# Altium project XDRONE.PrjPcb
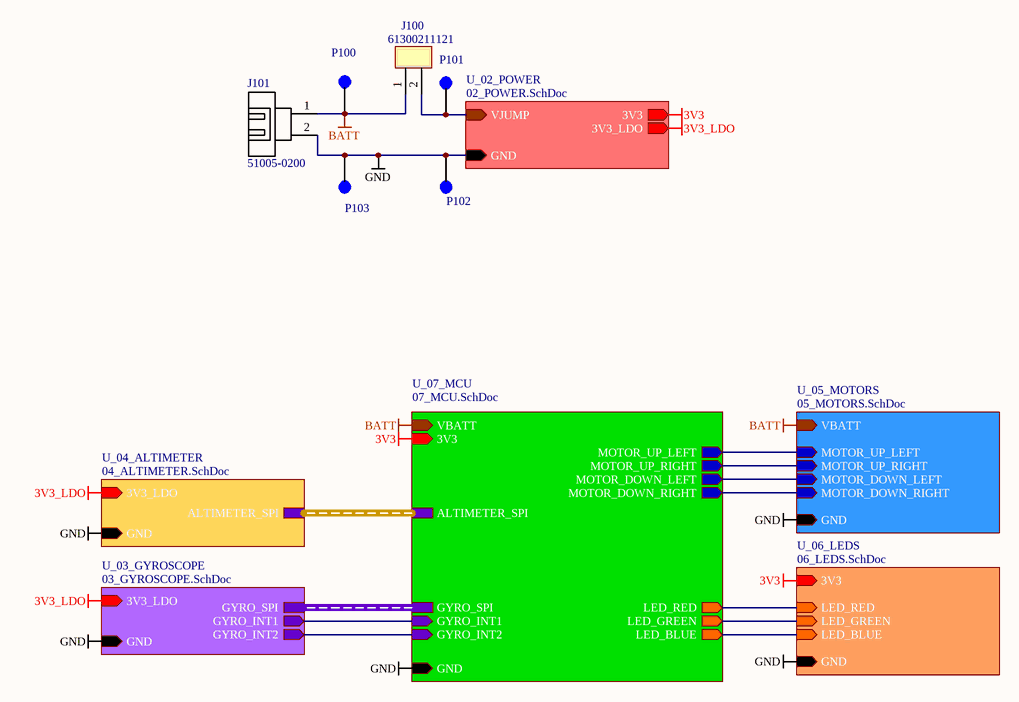
[diagram p0: 01_XDRONE.SchDoc]
8 sheets, 129 parts. Net scope: hierarchical (ports join the sheet entries above them; power ports are global).
Board file: XDRONE.PcbDoc
Sheets:
  01_XDRONE.SchDoc
    U_04_ALTIMETER = 04_ALTIMETER.SchDoc
    U_03_GYROSCOPE = 03_GYROSCOPE.SchDoc
    U_07_MCU = 07_MCU.SchDoc
      U_08_MCU_POWER = 08_MCU_POWER.SchDoc
    U_06_LEDS = 06_LEDS.SchDoc
    U_05_MOTORS = 05_MOTORS.SchDoc
    U_02_POWER = 02_POWER.SchDoc

## Sheet 01_XDRONE.SchDoc: XDRONE
size A4; Author: Gabriel; Organization: Altium Limited; Address1: L3, 12a Rodborough Rd; Address2: Frenchs Forest; Address3: NSW; Address4: Australia 2086; Revision: v2.0; SheetNumber: 1; SheetTotal: 8; Subtitle: MAIN

### Parts
J100  MANUFACTURER REFERENCE: 61300211121  [CON_2x1PIN_RA_61300211121]  (hidden comment: CON_2x1PIN_ST_61300211121_2.54)
J101  MANUFACTURER REFERENCE: 51005-0200  [CON_2x1PIN_MOLEX_51005-0200]  (hidden comment: CON_2x1PIN_MALE_51005-0200)
P100  TEST_POINT_2mm  [TEST_POINT_2mm]  (value not drawn)
P101  TEST_POINT_2mm  [TEST_POINT_2mm]  (value not drawn)
P102  TEST_POINT_2mm  [TEST_POINT_2mm]  (value not drawn)
P103  TEST_POINT_2mm  [TEST_POINT_2mm]  (value not drawn)

### Sub-sheets
U_02_POWER = 02_POWER.SchDoc: GND (in), 3V3 (out), 3V3_LDO (out), VJUMP (in)
U_03_GYROSCOPE = 03_GYROSCOPE.SchDoc: GND (in), GYRO_INT1 (out), GYRO_INT2 (out), GYRO_SPI (harness GYRO_SPI), 3V3_LDO (in)
U_04_ALTIMETER = 04_ALTIMETER.SchDoc: GND (in), ALTIMETER_SPI (harness ALTIMETER_SPI), 3V3_LDO (in)
U_05_MOTORS = 05_MOTORS.SchDoc: GND (in), VBATT (in), MOTOR_UP_LEFT (in), MOTOR_UP_RIGHT (in), MOTOR_DOWN_LEFT (in), MOTOR_DOWN_RIGHT (in)
U_06_LEDS = 06_LEDS.SchDoc: LED_GREEN (in), LED_RED (in), LED_BLUE (in), GND (in), 3V3 (in)
U_07_MCU = 07_MCU.SchDoc: GND (in), 3V3 (in), ALTIMETER_SPI (harness ALTIMETER_SPI), GYRO_SPI (harness GYRO_SPI), MOTOR_UP_LEFT (out), MOTOR_UP_RIGHT (out), MOTOR_DOWN_LEFT (out), MOTOR_DOWN_RIGHT (out), VBATT (in), LED_RED (out), LED_GREEN (out), LED_BLUE (out), GYRO_INT1 (in), GYRO_INT2 (in)

### Nets
3V3: sheet U_07_MCU/3V3, sheet U_06_LEDS/3V3, sheet U_02_POWER/3V3
3V3_LDO: sheet U_04_ALTIMETER/3V3_LDO, sheet U_03_GYROSCOPE/3V3_LDO, sheet U_02_POWER/3V3_LDO
BATT: J100.1 J101.1(GND) P100.1 ; sheet U_07_MCU/VBATT, sheet U_05_MOTORS/VBATT
GND: J101.2(VBATT) P102.1 P103.1 ; sheet U_04_ALTIMETER/GND, sheet U_03_GYROSCOPE/GND, sheet U_07_MCU/GND, sheet U_06_LEDS/GND, sheet U_05_MOTORS/GND, sheet U_02_POWER/GND
GYRO_INT1: sheet U_03_GYROSCOPE/GYRO_INT1, sheet U_07_MCU/GYRO_INT1
GYRO_INT2: sheet U_03_GYROSCOPE/GYRO_INT2, sheet U_07_MCU/GYRO_INT2
LED_BLUE: sheet U_07_MCU/LED_BLUE, sheet U_06_LEDS/LED_BLUE
LED_GREEN: sheet U_07_MCU/LED_GREEN, sheet U_06_LEDS/LED_GREEN
LED_RED: sheet U_07_MCU/LED_RED, sheet U_06_LEDS/LED_RED
MOTOR_DOWN_LEFT: sheet U_07_MCU/MOTOR_DOWN_LEFT, sheet U_05_MOTORS/MOTOR_DOWN_LEFT
MOTOR_DOWN_RIGHT: sheet U_07_MCU/MOTOR_DOWN_RIGHT, sheet U_05_MOTORS/MOTOR_DOWN_RIGHT
MOTOR_UP_LEFT: sheet U_07_MCU/MOTOR_UP_LEFT, sheet U_05_MOTORS/MOTOR_UP_LEFT
MOTOR_UP_RIGHT: sheet U_07_MCU/MOTOR_UP_RIGHT, sheet U_05_MOTORS/MOTOR_UP_RIGHT
NetD201_2: J100.2 P101.1 ; sheet U_02_POWER/VJUMP

### Buses and harness runs
harness sheet U_03_GYROSCOPE/GYRO_SPI = sheet U_07_MCU/GYRO_SPI
harness sheet U_04_ALTIMETER/ALTIMETER_SPI = sheet U_07_MCU/ALTIMETER_SPI

### Notes on the sheet
- TITLE:
- CREATED BY
- MODIFIED DATE
- REV
- PAGE
- /

### Library data of the parts
J100 = CON_2x1PIN_ST_61300211121_2.54: CONNECTOR 2x1 PIN ST 61300211121 WE 2.54 PITCH; CURRENT RATING: 3A; ANGLE: STRAIGHT; PITCH: 2.54 mm; GENDER: MALE; ROWS: 1; COLUMNS: 2; MANUFACTURER: WE; MOUNTING: THT
J101 = CON_2x1PIN_MALE_51005-0200: CONNECTOR 2x1PIN MALE 51005-0200; MANUFACTURER: MOLEX; ANGLE: STRAIGHT; ROWS: 2; COLUMNS: 1; MOUNTING: SMD; GENDER: MALE
P100-P103 = TEST_POINT_2mm: MOUNTING: SMD

## Sheet 04_ALTIMETER.SchDoc: ALTIMETER
size A4; Author: Gabriel; Organization: Altium Limited; Address1: L3, 12a Rodborough Rd; Address2: Frenchs Forest; Address3: NSW; Address4: Australia 2086; Revision: v2.0; SheetNumber: 4; SheetTotal: 8; Subtitle: XDRONE
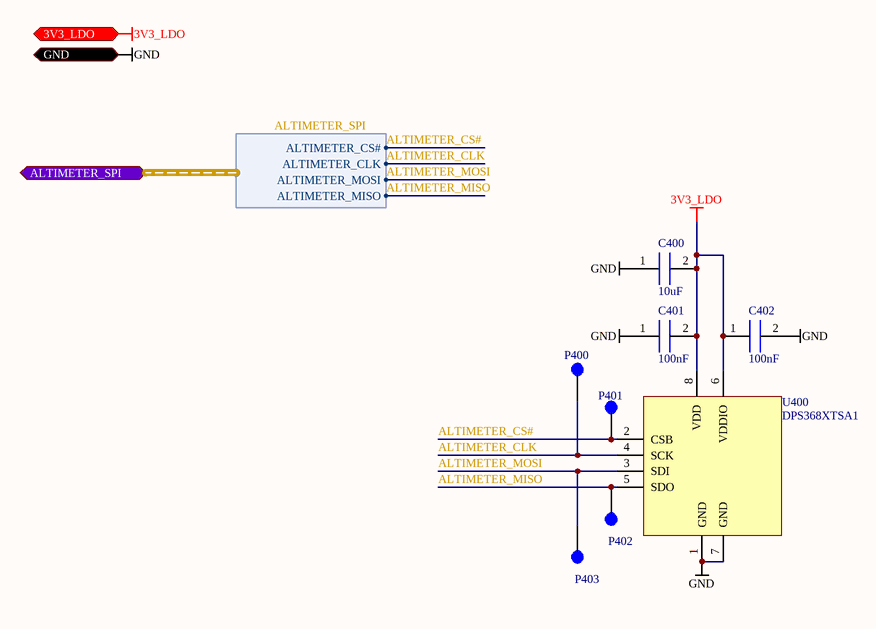
[diagram p1: 04_ALTIMETER.SchDoc]

### Parts
C400  value 10uF  [CAP_0402]  (hidden comment: 10uF_20%_6.3V_0402_GRM155R60J106ME05D)
C401  value 100nF  [CAP_0402]  (hidden comment: 100nF_10%_16V_0402_GRM155R71C104KA88J)
C402  value 100nF  [CAP_0402]  (hidden comment: 100nF_10%_16V_0402_GRM155R71C104KA88J)
P400  TEST_POINT_2mm  [TEST_POINT_2mm]  (value not drawn)
P401  TEST_POINT_2mm  [TEST_POINT_2mm]  (value not drawn)
P402  TEST_POINT_2mm  [TEST_POINT_2mm]  (value not drawn)
P403  TEST_POINT_2mm  [TEST_POINT_2mm]  (value not drawn)
U400  BAR_4V_0.002hPA_500nA_DPS368XTSA1  [DPS368XTSA1]  (value not drawn)

### Ports
3V3_LDO (in), ALTIMETER_SPI (harness ALTIMETER_SPI), GND (in)

### Harnesses
ALTIMETER_SPI: ALTIMETER_MISO, ALTIMETER_MOSI, ALTIMETER_CLK, ALTIMETER_CS#

### Nets
3V3_LDO: C400.2 C401.2 C402.1 U400.6(VDDIO) U400.8(VDD) ; port 3V3_LDO
GND: C400.1 C401.1 C402.2 U400.1(GND) U400.7(GND) ; port GND
ALTIMETER_CLK: P400.1 U400.4(SCK) ; port ALTIMETER_SPI.ALTIMETER_CLK
ALTIMETER_CS#: P401.1 U400.2(CSB) ; port ALTIMETER_SPI.ALTIMETER_CS#
ALTIMETER_MISO: P402.1 U400.5(SDO) ; port ALTIMETER_SPI.ALTIMETER_MISO
ALTIMETER_MOSI: P403.1 U400.3(SDI) ; port ALTIMETER_SPI.ALTIMETER_MOSI

### Notes on the sheet
- TITLE:
- CREATED BY
- MODIFIED DATE
- REV
- PAGE
- /

### Library data of the parts
C400 = 10uF 20% 6.3V 0402 GRM155R60J106ME05D: CAPACITOR 10uF 20% 6.3V 0402 GRM155R60J106ME05D; MANUFACTURER: MURATA; DIELECTRIC: X5R; TOLERANCE: 20%; VOLTAGE RATING: 6.3V; PACKAGING: 0402; MOUNTING: SMD; MANUFACTURER REFERENCE: GRM155R60J106ME05D
C401 C402 = 100nF_10%_16V_0402_GRM155R71C104KA88J: CAPACITOR 100nF 10% X7R 0402; MANUFACTURER: MURATA; VOLTAGE RATING: 16V; DIELECTRIC: X7R; TOLERANCE: 10%; MOUNTING: SMD; MANUFACTURER REFERENCE: GRM155R71C104KA88J; PACKAGING: 0402
U400 = BAR_4V_0.002hPA_500nA_DPS368XTSA1: BAROMETRIC SENSOR 4V 0.002hPA 500nA DPS368XTSA1; MANUFACTURER: INFINEON; INPUT VOLTAGE MIN: 1.7V; CURRENT MAX: 350uA; NUMBER OF GATES: 1; INPUT VOLTAGE MAX: 4V; PACKAGING: 8-VFLGA; MOUNTING: SMD; MANUFACTURER REFERENCE: DPS368XTSA1
P400-P403 = TEST_POINT_2mm: MOUNTING: SMD

## Sheet 03_GYROSCOPE.SchDoc: GYRO
size A4; Author: Gabriel; Organization: Altium Limited; Address1: L3, 12a Rodborough Rd; Address2: Frenchs Forest; Address3: NSW; Address4: Australia 2086; Revision: v2.0; SheetNumber: 3; SheetTotal: 8; Subtitle: XDRONE
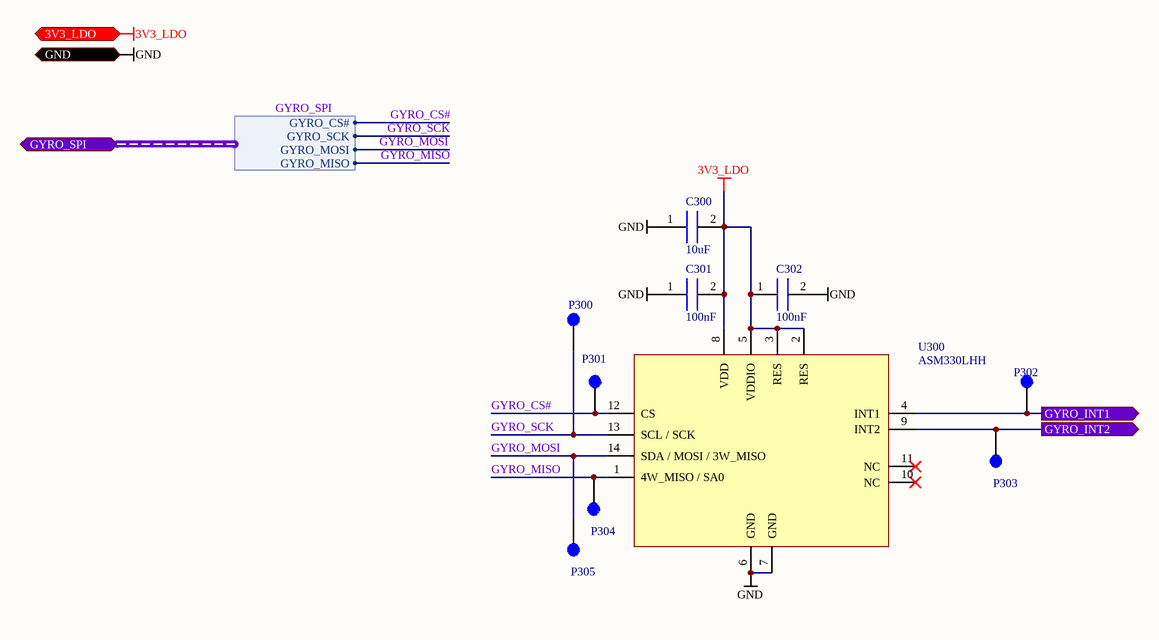
[diagram p2: 03_GYROSCOPE.SchDoc]

### Parts
C300  value 10uF  [CAP_0402]  (hidden comment: 10uF_20%_6.3V_0402_GRM155R60J106ME05D)
C301  value 100nF  [CAP_0402]  (hidden comment: 100nF_10%_16V_0402_GRM155R71C104KA88J)
C302  value 100nF  [CAP_0402]  (hidden comment: 100nF_10%_16V_0402_GRM155R71C104KA88J)
P300  TEST_POINT_2mm  [TEST_POINT_2mm]  (value not drawn)
P301  TEST_POINT_2mm  [TEST_POINT_2mm]  (value not drawn)
P302  TEST_POINT_2mm  [TEST_POINT_2mm]  (value not drawn)
P303  TEST_POINT_2mm  [TEST_POINT_2mm]  (value not drawn)
P304  TEST_POINT_2mm  [TEST_POINT_2mm]  (value not drawn)
P305  TEST_POINT_2mm  [TEST_POINT_2mm]  (value not drawn)
U300  MANUFACTURER REFERENCE: ASM330LHH  [LGA14]  (hidden comment: GYRO_3D_3.6V_ACEL_ASM330LHH)

### Ports
3V3_LDO (in), GND (in), GYRO_INT1 (out), GYRO_INT2 (out), GYRO_SPI (harness GYRO_SPI)

### Harnesses
GYRO_SPI: GYRO_CS#, GYRO_SCK, GYRO_MOSI, GYRO_MISO

### Nets
3V3_LDO: C300.2 C301.2 C302.1 U300.2(RES) U300.3(RES) U300.5(VDDIO) U300.8(VDD) ; port 3V3_LDO
GND: C300.1 C301.1 C302.2 U300.6(GND) U300.7(GND) ; port GND
GYRO_CS#: P301.1 U300.12(CS) ; port GYRO_SPI.GYRO_CS#
GYRO_INT1: P302.1 U300.4(INT1) ; port GYRO_INT1
GYRO_INT2: P303.1 U300.9(INT2) ; port GYRO_INT2
GYRO_MISO: P304.1 U300.1(4W_MISO_/_SA0) ; port GYRO_SPI.GYRO_MISO
GYRO_MOSI: P305.1 U300.14(SDA_/_MOSI_/_3W_MISO) ; port GYRO_SPI.GYRO_MOSI
GYRO_SCK: P300.1 U300.13(SCL_/_SCK) ; port GYRO_SPI.GYRO_SCK

Not connected (* = marked no-connect by the designer): U300 10(NC)* 11(NC)*

### Notes on the sheet
- TITLE:
- CREATED BY
- MODIFIED DATE
- REV
- PAGE
- /

### Library data of the parts
C300 = 10uF 20% 6.3V 0402 GRM155R60J106ME05D: as C400 on sheet 04_ALTIMETER; TOLERANCE: 20%; VOLTAGE RATING: 6.3V; PACKAGING: 0402; MOUNTING: SMD; MANUFACTURER REFERENCE: GRM155R60J106ME05D
C301 C302 = 100nF_10%_16V_0402_GRM155R71C104KA88J: as C401 on sheet 04_ALTIMETER; DIELECTRIC: X7R; TOLERANCE: 10%; MOUNTING: SMD; MANUFACTURER REFERENCE: GRM155R71C104KA88J; PACKAGING: 0402
U300 = GYRO_3D_3.6V_ACEL_ASM330LHH: Gyroscope and accelerometer 3D 3.6V ASM330LHH; MANUFACTURER: ST; INPUT VOLTAGE MIN: 2V; INPUT VOLTAGE MAX: 3.6V; PACKAGING: 14-LGA; MOUNTING: SMD
P300-P305 = TEST_POINT_2mm: MOUNTING: SMD

## Sheet 07_MCU.SchDoc: MCU
size A4; Author: Gabriel; Organization: Altium Limited; Address1: L3, 12a Rodborough Rd; Address2: Frenchs Forest; Address3: NSW; Address4: Australia 2086; Revision: v2.0; SheetNumber: 7; SheetTotal: 8; Subtitle: XDRONE
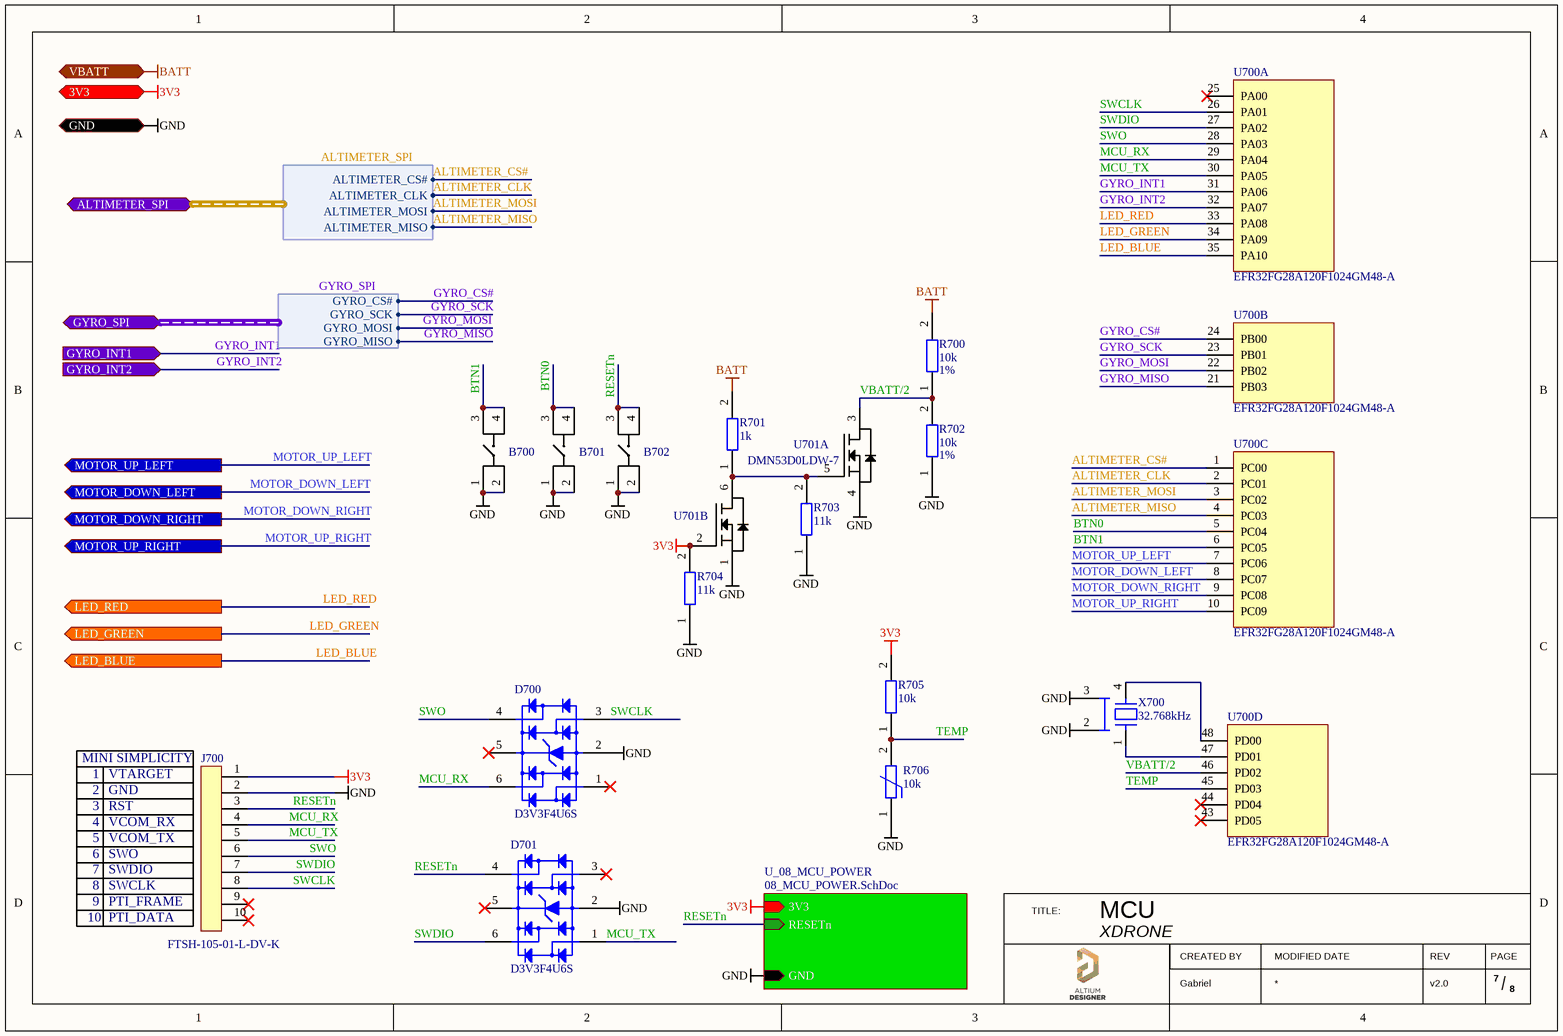
[diagram p3: 07_MCU.SchDoc]

### Parts
B700  BTN_1B_PTS647SK38SMTR2LFS  [BTN_SMD]  (value not drawn)
B701  BTN_1B_PTS647SK38SMTR2LFS  [BTN_SMD]  (value not drawn)
B702  BTN_1B_PTS647SK38SMTR2LFS  [BTN_SMD]  (value not drawn)
D700  MANUFACTURER REFERENCE: D3V3F4U6S  [SOT-363 SC-70-6]  (hidden comment: ESD_D3V3F4U6S)
D701  MANUFACTURER REFERENCE: D3V3F4U6S  [SOT-363 SC-70-6]  (hidden comment: ESD_D3V3F4U6S)
J700  MANUFACTURER REFERENCE: FTSH-105-01-L-DV-K  [CON_5x2PIN_RA_FTSH-105-01-L-DV-K]  (hidden comment: CON_5x2PIN_RA_1.27_FTSH-105-01-L-DV-K)
R700  value 10k  TOLERANCE: 1%  [RES_0402]  (hidden comment: RES_10k_1%_0402_RC0402FR-0710KL)
R701  value 1k  [RES_0402]  (hidden comment: RES_1k_1%_0402_RC0402FR-071KL)
R702  value 10k  TOLERANCE: 1%  [RES_0402]  (hidden comment: RES_10k_1%_0402_RC0402FR-0710KL)
R703  value 11k  [RES_0402]  (hidden comment: RES_11k_5%_0402_ERJ-2GEJ113X)
R704  value 11k  [RES_0402]  (hidden comment: RES_11k_5%_0402_ERJ-2GEJ113X)
R705  value 10k  [RES_0402]  (hidden comment: RES_10k_1%_0402_RC0402FR-0710KL)
R706  value 10k  [RES_0402]  (hidden comment: THER_10k_1%_0402_NTCG103JF103FT1)
U700  MANUFACTURER REFERENCE: EFR32FG28A120F1024GM48-A  [QFN48]  (hidden comment: MCU_1MB_256kB_EFR32FG28A120F1024GM48-A)  (parts A,B,C,D of 6)
U701  MANUFACTURER REFERENCE: DMN53D0LDW-7  [SOT-363 SC-70-6]  (hidden comment: MOS_2G_50VDS_360mA_0.8Vth_DMN53D0LDW-7)  (parts A,B of 2)
X700  FREQUENCY: 32.768kHz  [4-SOJ]  (hidden comment: QUARTZ_32.768kHz_20ppm_830016178)

### Sub-sheets
U_08_MCU_POWER = 08_MCU_POWER.SchDoc: GND (in), 3V3 (in), RESETn (in)

### Ports
3V3 (in), ALTIMETER_SPI (harness ALTIMETER_SPI), GND (in), GYRO_INT1 (in), GYRO_INT2 (in), GYRO_SPI (harness GYRO_SPI), LED_BLUE (out), LED_GREEN (out), LED_RED (out), MOTOR_DOWN_LEFT (out), MOTOR_DOWN_RIGHT (out), MOTOR_UP_LEFT (out), MOTOR_UP_RIGHT (out), VBATT (in)

### Harnesses
ALTIMETER_SPI: ALTIMETER_MISO, ALTIMETER_MOSI, ALTIMETER_CLK, ALTIMETER_CS#
GYRO_SPI: GYRO_CS#, GYRO_SCK, GYRO_MOSI, GYRO_MISO

### Nets
3V3: J700.1 R704.2 R705.2 U701.2 ; port 3V3, sheet U_08_MCU_POWER/3V3
BATT: R700.2 R701.2 ; port VBATT
GND: B700.1 B700.2 B701.1 B701.2 B702.1 B702.2 D700.2 D701.2 J700.2 R702.1 R703.1 R704.1 R706.1 U701.1 U701.4 X700.2 X700.3 ; port GND, sheet U_08_MCU_POWER/GND
ALTIMETER_CLK: U700.2(PC01) ; port ALTIMETER_SPI.ALTIMETER_CLK
ALTIMETER_CS#: U700.1(PC00) ; port ALTIMETER_SPI.ALTIMETER_CS#
ALTIMETER_MISO: U700.4(PC03) ; port ALTIMETER_SPI.ALTIMETER_MISO
ALTIMETER_MOSI: U700.3(PC02) ; port ALTIMETER_SPI.ALTIMETER_MOSI
BTN0: B701.3 B701.4 U700.5(PC04)
BTN1: B700.3 B700.4 U700.6(PC05)
GYRO_CS#: U700.24(PB00) ; port GYRO_SPI.GYRO_CS#
GYRO_INT1: U700.31(PA06) ; port GYRO_INT1
GYRO_INT2: U700.32(PA07) ; port GYRO_INT2
GYRO_MISO: U700.21(PB03) ; port GYRO_SPI.GYRO_MISO
GYRO_MOSI: U700.22(PB02) ; port GYRO_SPI.GYRO_MOSI
GYRO_SCK: U700.23(PB01) ; port GYRO_SPI.GYRO_SCK
LED_BLUE: U700.35(PA10) ; port LED_BLUE
LED_GREEN: U700.34(PA09) ; port LED_GREEN
LED_RED: U700.33(PA08) ; port LED_RED
MCU_RX: D700.6 J700.4 U700.29(PA04)
MCU_TX: D701.1 J700.5 U700.30(PA05)
MOTOR_DOWN_LEFT: U700.8(PC07) ; port MOTOR_DOWN_LEFT
MOTOR_DOWN_RIGHT: U700.9(PC08) ; port MOTOR_DOWN_RIGHT
MOTOR_UP_LEFT: U700.7(PC06) ; port MOTOR_UP_LEFT
MOTOR_UP_RIGHT: U700.10(PC09) ; port MOTOR_UP_RIGHT
RESETn: B702.3 B702.4 D701.4 J700.3 ; sheet U_08_MCU_POWER/RESETn
SWCLK: D700.3 J700.8 U700.26(PA01)
SWDIO: D701.6 J700.7 U700.27(PA02)
SWO: D700.4 J700.6 U700.28(PA03)
TEMP: R705.1 R706.2 U700.45(PD03)
VBATT/2: R700.1 R702.2 U700.46(PD02) U701.3
NetR701_1: R701.1 R703.2 U701.5 U701.6
NetU700_47: U700.47(PD01) X700.1
NetU700_48: U700.48(PD00) X700.4

Not connected (* = marked no-connect by the designer): D700 1* 5*; D701 3* 5*; J700 9* 10*; U700 25(PA00)* 43(PD05)* 44(PD04)*

### Notes on the sheet
- (near J700) MINI SIMPLICITY
- 1
- VTARGET
- 2
- 3
- 4
- 5
- GND
- RST
- VCOM_RX
- VCOM_TX
- 10
- 6
- 7
- 8
- 9
- SWO
- SWDIO
- SWCLK
- (near J700) PTI_FRAME
- PTI_DATA
- TITLE:
- CREATED BY
- MODIFIED DATE
- REV
- PAGE
- /

### Library data of the parts
B700-B702 = BTN_1B_PTS647SK38SMTR2LFS: Button PTS647SK38SMTR2LFS; MANUFACTURER: C&K; NUMBER OF BUTTONS: 1; DIRECTION: STRAIGHT; MOUNTING: SMD; MANUFACTURER REFERENCE: PTS647SK38SMTR2LFS
D700 D701 = ESD_D3V3F4U6S: 4 CH ESD PROTECTION SOT363 LOW CAP D3V3F4U6S; MANUFACTURER: DIODES INC; DRAW BY: ToV; LATEST REVISION NOTE: CREATION; VF DIODE: 1.1V; NB OF CHANNEL: 4; UL94: V-0; DRAW DATE: 02/05/2022; LATEST REVISION DATE: 02/05/2022; STATUS: ACTIVE; OPERATING TEMPERATURE: -55 +150°C; TYPE: ESD; PEAK CURRENT: --; AVERAGE CURRENT: *; MAX POWER DISSIPATION: --; ROHS: ROHS; WEIGHT (g): 0.006; MOUNTING: SMD; PACKAGING: SOT363
J700 = CON_5x2PIN_RA_1.27_FTSH-105-01-L-DV-K: CONNECTOR 5x2PIN RA 1.27 PITCH FTSH-105-01-L-DV-K; MANUFACTURER: SAMTEC; CURRENT RATING: 3A; PITCH: 1.27 mm; GENDER: MALE; ROWS: 2; COLUMNS: 5; ROW SPACING: 1.27; MOUNTING: SMD; ANGLE: RA
R700 R702 R705 = RES_10k_1%_0402_RC0402FR-0710KL: RESISTOR 10k 1% 0402 RC0402FR-0710KL; MANUFACTURER: YAGEO; VOLTAGE RATING: 50V; MOUNTING: SMD; MANUFACTURER REFERENCE: RC0402FR-0710KL; PACKAGING: 0402
  R705: TOLERANCE: 1%
R701 = RES_1k_1%_0402_RC0402FR-071KL: RESISTOR 1k 1% 0402 RC0402FR-071KL; MANUFACTURER: YAGEO; VOLTAGE RATING: 50V; TOLERANCE: 1%; MOUNTING: SMD; MANUFACTURER REFERENCE: RC0402FR-071KL; PACKAGING: 0402
R703 R704 = RES_11k_5%_0402_ERJ-2GEJ113X: RESISTOR 11k 5% 0402 ERJ-2GEJ113X; MANUFACTURER: PANASONIC; VOLTAGE RATING: 50V; TOLERANCE: 5%; MOUNTING: SMD; MANUFACTURER REFERENCE: ERJ-2GEJ113X; PACKAGING: 0402
R706 = THER_10k_1%_0402_NTCG103JF103FT1: THERMISTANCE 10k 1% 0402 NTCG103JF103FT1; MANUFACTURER: TDK; VOLTAGE RATING: 50V; TOLERANCE: 1%; MOUNTING: SMD; MANUFACTURER REFERENCE: NTCG103JF103FT1; PACKAGING: 0402
U700 = MCU_1MB_256kB_EFR32FG28A120F1024GM48-A: MCU 1MB 256kB EFR32FG28A120F1024GM48-A; MANUFACTURER: SILICON LABS; PACKAGING: QFN48 0606; FLASH SIZE: 1 MB; RAM SIZE: 256 KB; PIN COUNT: 48; MOUNTING: SMD
U701 = MOS_2G_50VDS_360mA_0.8Vth_DMN53D0LDW-7: MOS 2GATES 50VDS 360mA 0.8Vth; MANUFACTURER: DIODES; VOLTAGE DS MAX: 50; NUMBER OF GATES: 2; VOLTAGE THRESHOLD: 0.8V; CURRENT MAX: 360mA; PACKAGING: SOT-363-6; MOUNTING: SMD
X700 = QUARTZ_32.768kHz_20ppm_830016178: QUARTZ 32.768kHz 20ppm 830016178; MANUFACTURER: WURTH; MANUFACTURER REFERENCE: 830016178; MOUNTING: SMD; PACKAGING: 4-SOJ; TOLERANCE: 20 ppm

## Sheet 08_MCU_POWER.SchDoc: MCU POWER
size A4; Author: Gabriel; Organization: Altium Limited; Address1: L3, 12a Rodborough Rd; Address2: Frenchs Forest; Address3: NSW; Address4: Australia 2086; Revision: v2.0; SheetNumber: 8; SheetTotal: 8; Subtitle: XDRONE
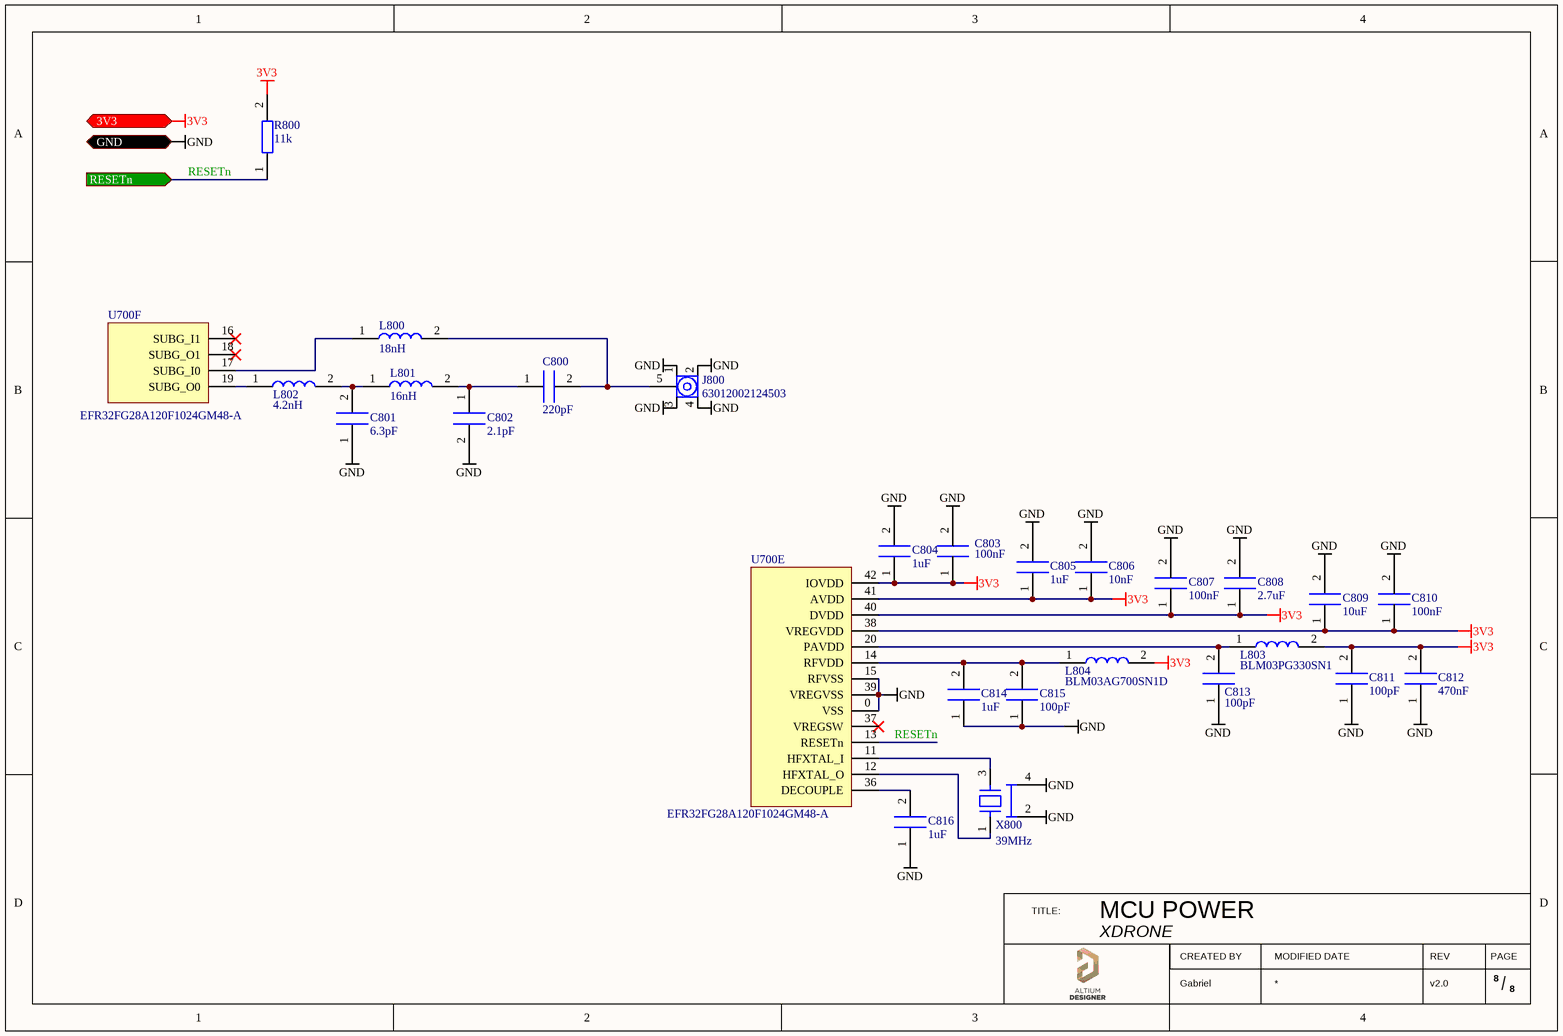
[diagram p4: 08_MCU_POWER.SchDoc]

### Parts
C800  value 220pF  [CAP_0805]  (hidden comment: 220pF_5%_50V_0805_C0G,NP0_QSCT251Q221J1GV001E)
C801  value 6.3pF  [CAP_0402]  (hidden comment: 6.3pF_1.5%_50V_0402_CBR04C639B5GAC)
C802  value 2.1pF  [CAP_0402]  (hidden comment: 2.1pF_5%_50V_0402_GJM1555C1H2R1BB01D)
C803  value 100nF  [CAP_0402]  (hidden comment: 100nF_10%_16V_0402_GRM155R71C104KA88J)
C804  value 1uF  [CAP_0402]  (hidden comment: 1uF_10%_35V_0402_GRM155R6YA105KE11J)
C805  value 1uF  [CAP_0402]  (hidden comment: 1uF_10%_35V_0402_GRM155R6YA105KE11J)
C806  value 10nF  [CAP_0402]  (hidden comment: 10nF_10%_6.3V_0402_CC0402KRX7R5BB103)
C807  value 100nF  [CAP_0402]  (hidden comment: 100nF_10%_16V_0402_GRM155R71C104KA88J)
C808  value 2.7uF  [CAP_0805]  (hidden comment: 2.7uF_10%_10V_0805_X5R_C0805C275K8PAC7800)
C809  value 10uF  [CAP_0402]  (hidden comment: 10uF_20%_6.3V_0402_GRM155R60J106ME05D)
C810  value 100nF  [CAP_0402]  (hidden comment: 100nF_10%_16V_0402_GRM155R71C104KA88J)
C811  value 100pF  [CAP_0402]  (hidden comment: 100pF_5%_50V_0402_CC0402JRNPO9BN101)
C812  value 470nF  [CAP_0402]  (hidden comment: 470nF_10%_6.3V_0402_GRM155C80J474KE19D)
C813  value 100pF  [CAP_0402]  (hidden comment: 100pF_5%_50V_0402_CC0402JRNPO9BN101)
C814  value 1uF  [CAP_0402]  (hidden comment: 1uF_10%_35V_0402_GRM155R6YA105KE11J)
C815  value 100pF  [CAP_0402]  (hidden comment: 100pF_5%_50V_0402_CC0402JRNPO9BN101)
C816  value 1uF  [CAP_0402]  (hidden comment: 1uF_10%_35V_0402_GRM155R6YA105KE11J)
J800  MANUFACTURER REFERENCE: 63012002124503  [RF_63012002124503]  (hidden comment: RF_63012002124503)
L800  value 18nH  [RF_IND_0402]  (hidden comment: 18nH_2%_400mA_LQG15HS18NG02D)
L801  value 16nH  [RF_IND_0402]  (hidden comment: 16nH_3%_400mA_MLG1005S16NHT000)
L802  value 4.2nH  [RF_IND_0402]  (hidden comment: 4.2nH_5%_1.8A_LQW15AN4N2C8ZD)
L803  MANUFACTURER REFERENCE: BLM03PG330SN1  [IND_0201]  (hidden comment: 52nH_25%_750mA_BLM03PG330SN1)
L804  MANUFACTURER REFERENCE: BLM03AG700SN1D  [IND_0201]  (hidden comment: 110nH_50%_200mA_BLM03AG700SN1D)
R800  value 11k  [RES_0402]  (hidden comment: RES_11k_5%_0402_ERJ-2GEJ113X)
U700  MANUFACTURER REFERENCE: EFR32FG28A120F1024GM48-A  [QFN48]  (hidden comment: MCU_1MB_256kB_EFR32FG28A120F1024GM48-A)  (parts E,F of 6)
X800  FREQUENCY: 39MHz  [4-SMD]  (hidden comment: QUARTZ_39MHz_10ppm_ECS-390-10-37B-CKM-TR)

### Ports
3V3 (in), GND (in), RESETn (in)

### Nets
3V3: C803.1 C804.1 C805.1 C806.1 C807.1 C808.1 C809.1 C810.1 C811.2 C812.2 L803.2 L804.2 R800.2 U700.38(VREGVDD) U700.40(DVDD) U700.41(AVDD) U700.42(IOVDD) ; port 3V3
GND: C801.1 C802.2 C803.2 C804.2 C805.2 C806.2 C807.2 C808.2 C809.2 C810.2 C811.1 C812.1 C813.1 C814.1 C815.1 C816.1 J800.1 J800.2 J800.3 J800.4 U700.0(VSS) U700.15(RFVSS) U700.39(VREGVSS) X800.2 X800.4 ; port GND
RESETn: R800.1 U700.13(RESETn) ; port RESETn
NetC800_1: C800.1 C802.1 L801.2
NetC800_2: C800.2 J800.5 L800.2
NetC801_2: C801.2 L801.1 L802.2
NetC813_2: C813.2 L803.1 U700.20(PAVDD)
NetC814_2: C814.2 C815.2 L804.1 U700.14(RFVDD)
NetC816_2: C816.2 U700.36(DECOUPLE)
NetL800_1: L800.1 U700.17(SUBG_I0)
NetL802_1: L802.1 U700.19(SUBG_O0)
NetU700_11: U700.11(HFXTAL_I) X800.3
NetU700_12: U700.12(HFXTAL_O) X800.1

Not connected (* = marked no-connect by the designer): U700 16(SUBG_I1)* 18(SUBG_O1)* 37(VREGSW)*

### Notes on the sheet
- TITLE:
- CREATED BY
- MODIFIED DATE
- REV
- PAGE
- /

### Library data of the parts
C800 = 220pF_5%_50V_0805_C0G,NP0_QSCT251Q221J1GV001E: CAP 220pF 5% 50V 0805 C0G,NP0; MANUFACTURER: JOHANSON TECHLONOGY; DIELECTRIC: C0G, NP0; TOLERANCE: 5%; VOLTAGE RATING: 50V; PACKAGING: 0805; MOUNTING: SMD; MANUFACTURER REFERENCE: QSCT251Q221J1GV001E
C801 = 6.3pF_1.5%_50V_0402_CBR04C639B5GAC: CAPACITOR 6.3pF 1.5% 50V 0402 CBR04C639B5GAC; MANUFACTURER: KEMET; DIELECTRIC: C0G, NP0; TOLERANCE: 1.5%; VOLTAGE RATING: 50V; PACKAGING: 0402; MOUNTING: SMD; MANUFACTURER REFERENCE: CBR04C639B5GAC
C802 = 2.1pF_5%_50V_0402_GJM1555C1H2R1BB01D: CAPACITOR 2.1pF 5% 50V 0402 GJM1555C1H2R1BB01D; MANUFACTURER: MURATA; DIELECTRIC: C0G, NP0; TOLERANCE: 5%; VOLTAGE RATING: 50V; PACKAGING: 0402; MOUNTING: SMD; MANUFACTURER REFERENCE: GJM1555C1H2R1BB01D
C803 C807 C810 = 100nF_10%_16V_0402_GRM155R71C104KA88J: as C401 on sheet 04_ALTIMETER; DIELECTRIC: X7R; TOLERANCE: 10%; PACKAGING: 0402; MOUNTING: SMD; MANUFACTURER REFERENCE: GRM155R71C104KA88J
C804 C805 C814 C816 = 1uF_10%_35V_0402_GRM155R6YA105KE11J: CAPACITOR 1uF 10% X5R 0402; MANUFACTURER: MURATA; VOLTAGE RATING: 35V; DIELECTRIC: X5R; TOLERANCE: 10%; PACKAGING: 0402; MOUNTING: SMD; MANUFACTURER REFERENCE: GRM155R6YA105KE11J
C806 = 10nF_10%_6.3V_0402_CC0402KRX7R5BB103: CAPACITOR 10nF 10% 6.3V 0402 CC0402KRX7R5BB103; MANUFACTURER: YAGEO; DIELECTRIC: X7R; TOLERANCE: 10%; VOLTAGE RATING: 6.3V; PACKAGING: 0402; MOUNTING: SMD; MANUFACTURER REFERENCE: CC0402KRX7R5BB103
C808 = 2.7uF_10%_10V_0805_X5R_C0805C275K8PAC7800: CAP 2.7uF 10% 10V 0805 X5R C0805C275K8PAC7800; MANUFACTURER: KEMET; DIELECTRIC: X5R; TOLERANCE: 10%; VOLTAGE RATING: 10V; PACKAGING: 0805; MOUNTING: SMD; MANUFACTURER REFERENCE: C0805C275K8PAC7800
C809 = 10uF 20% 6.3V 0402 GRM155R60J106ME05D: as C400 on sheet 04_ALTIMETER; TOLERANCE: 20%; VOLTAGE RATING: 6.3V; PACKAGING: 0402; MOUNTING: SMD; MANUFACTURER REFERENCE: GRM155R60J106ME05D
C811 C813 C815 = 100pF_5%_50V_0402_CC0402JRNPO9BN101: CAPACITOR 100pF 5% 50V 0402 CC0402JRNPO9BN101; MANUFACTURER: YAGEO; DIELECTRIC: C0G, NP0; TOLERANCE: 5%; VOLTAGE RATING: 50V; PACKAGING: 0402; MOUNTING: SMD; MANUFACTURER REFERENCE: CC0402JRNPO9BN101
C812 = 470nF_10%_6.3V_0402_GRM155C80J474KE19D: CAPACITOR 470nF 10% 6.3V 0402 GRM155C80J474KE19D; MANUFACTURER: MURATA; DIELECTRIC: X6S; TOLERANCE: 10%; VOLTAGE RATING: 6.3V; PACKAGING: 0402; MOUNTING: SMD; MANUFACTURER REFERENCE: GRM155C80J474KE19D
J800 = RF_63012002124503: RF Connector 63012002124503; MANUFACTURER: WE; PITCH: 2.54 mm; RATED VOLTAGE: 1000V; MOUNTING: THT
L800 = 18nH_2%_400mA_LQG15HS18NG02D: INDUCTOR 18nH 2% 400mA LQG15HS18NG02D; MANUFACTURER: MURATA; TOLERANCE: 2%; PACKAGING: 0402; MOUNTING: SMD; CURRENT RATING: 400mA; MANUFACTURER REFERENCE: LQG15HS18NG02D
L801 = 16nH_3%_400mA_MLG1005S16NHT000: INDUCTOR 16nH 3% 400mA MLG1005S16NHT000; MANUFACTURER: TDK; TOLERANCE: 3%; PACKAGING: 0402; MOUNTING: SMD; CURRENT RATING: 400mA; MANUFACTURER REFERENCE: MLG1005S16NHT000
L802 = 4.2nH_5%_1.8A_LQW15AN4N2C8ZD: INDUCTOR 4.2nH 5% 1.8A LQW15AN4N2C8ZD; MANUFACTURER: MURATA; TOLERANCE: 5%; PACKAGING: 0402; MOUNTING: SMD; CURRENT RATING: 1.8A; MANUFACTURER REFERENCE: LQW15AN4N2C8ZD
L803 = 52nH_25%_750mA_BLM03PG330SN1: INDUCTOR 52uH 25% 750mA BLM03PG330SN1; MANUFACTURER: MURATA; VALUE: 52nF; TOLERANCE: 25%; PACKAGING: 0201; MOUNTING: SMD; CURRENT RATING: 750mA
L804 = 110nH 50% 200mA BLM03AG700SN1D: INDUCTOR 110nH 50% 200mA BLM03AG700SN1D; MANUFACTURER: MURATA; TOLERANCE: 50%; PACKAGING: 0201; MOUNTING: SMD; CURRENT RATING: 200mA; VALUE: 110nH
R800 = RES_11k_5%_0402_ERJ-2GEJ113X: as R703 on sheet 07_MCU; TOLERANCE: 5%; MOUNTING: SMD; MANUFACTURER REFERENCE: ERJ-2GEJ113X; PACKAGING: 0402
U700 = MCU_1MB_256kB_EFR32FG28A120F1024GM48-A: as U700 on sheet 07_MCU; PACKAGING: QFN48 0606; FLASH SIZE: 1 MB; RAM SIZE: 256 KB; PIN COUNT: 48; MOUNTING: SMD
X800 = QUARTZ_39MHz_10ppm_ECS-390-10-37B-CKM-TR: QUARTZ 39MHz 10ppm ECS-390-10-37B-CKM-TR; MANUFACTURER: ECS; MANUFACTURER REFERENCE: ECS-390-10-37B-CKM-TR; MOUNTING: SMD; PACKAGING: 4-SMD; TOLERANCE: 10 ppm; STABILITY: 10 ppm

## Sheet 06_LEDS.SchDoc: LED
size A4; Author: Gabriel; Organization: Altium Limited; Address1: L3, 12a Rodborough Rd; Address2: Frenchs Forest; Address3: NSW; Address4: Australia 2086; Revision: v2.0; SheetNumber: 6; SheetTotal: 8; Subtitle: XDRONE
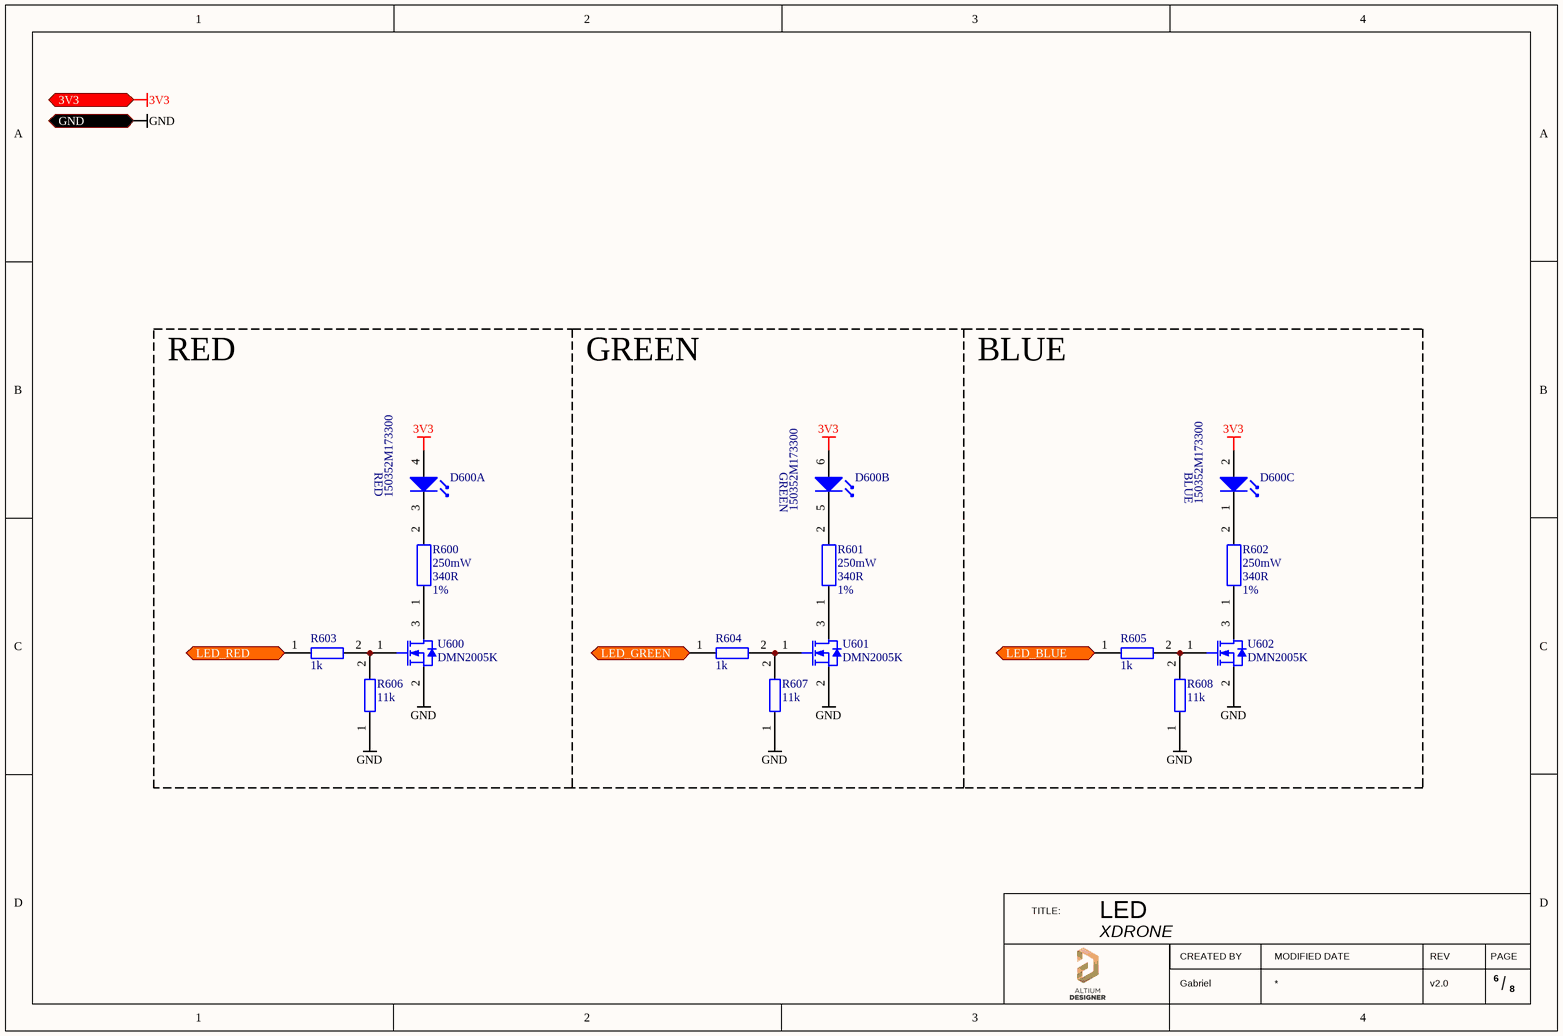
[diagram p5: 06_LEDS.SchDoc]

### Parts
D600  MANUFACTURER REFERENCE: 150352M173300  [6-PLCC]  (hidden comment: LED_PLCC6_RGB_150352M173300)  (parts A,B,C of 3)
R600  value 340R  MAX POWER DISSIPATION: 250mW  TOLERANCE: 1%  [RES_0805]  (hidden comment: RC_0805_340R_1/4W_1%_M)
R601  value 340R  MAX POWER DISSIPATION: 250mW  TOLERANCE: 1%  [RES_0805]  (hidden comment: RC_0805_340R_1/4W_1%_M)
R602  value 340R  MAX POWER DISSIPATION: 250mW  TOLERANCE: 1%  [RES_0805]  (hidden comment: RC_0805_340R_1/4W_1%_M)
R603  value 1k  [RES_0402]  (hidden comment: RES_1k_1%_0402_RC0402FR-071KL)
R604  value 1k  [RES_0402]  (hidden comment: RES_1k_1%_0402_RC0402FR-071KL)
R605  value 1k  [RES_0402]  (hidden comment: RES_1k_1%_0402_RC0402FR-071KL)
R606  value 11k  [RES_0402]  (hidden comment: RES_11k_5%_0402_ERJ-2GEJ113X)
R607  value 11k  [RES_0402]  (hidden comment: RES_11k_5%_0402_ERJ-2GEJ113X)
R608  value 11k  [RES_0402]  (hidden comment: RES_11k_5%_0402_ERJ-2GEJ113X)
U600  MANUFACTURER REFERENCE: DMN2005K  [SOT-23]  (hidden comment: MOS_N_1G_0.3A_DMN2005K)
U601  MANUFACTURER REFERENCE: DMN2005K  [SOT-23]  (hidden comment: MOS_N_1G_0.3A_DMN2005K)
U602  MANUFACTURER REFERENCE: DMN2005K  [SOT-23]  (hidden comment: MOS_N_1G_0.3A_DMN2005K)

### Blocks framed on the sheet
RED: D600 R600 R603 R606 U600

### Ports
3V3 (in), GND (in), LED_BLUE (in), LED_GREEN (in), LED_RED (in)

### Nets
3V3: D600.2(AB) D600.4(AR) D600.6(AG) ; port 3V3
GND: R606.1 R607.1 R608.1 U600.2(S) U601.2(S) U602.2(S) ; port GND
LED_BLUE: R605.1 ; port LED_BLUE
LED_GREEN: R604.1 ; port LED_GREEN
LED_RED: R603.1 ; port LED_RED
NetD600_1: D600.1(KB) R602.2
NetD600_3: D600.3(KR) R600.2
NetD600_5: D600.5(KG) R601.2
NetR600_1: R600.1 U600.3(D)
NetR601_1: R601.1 U601.3(D)
NetR602_1: R602.1 U602.3(D)
NetR603_2: R603.2 R606.2 U600.1(G)
NetR604_2: R604.2 R607.2 U601.1(G)
NetR605_2: R605.2 R608.2 U602.1(G)

### Notes on the sheet
- GREEN
- BLUE
- TITLE:
- CREATED BY
- MODIFIED DATE
- REV
- PAGE
- /
- (in symbol LED_PLCC6_RGB_150352M173300, part A) RED
- (in symbol LED_PLCC6_RGB_150352M173300, part B) GREEN
- (in symbol LED_PLCC6_RGB_150352M173300, part C) BLUE

### Library data of the parts
D600 = LED_PLCC6_RGB_150352M173300: CBI LED RGB PLCC6 150352M173300; MANUFACTURER: WURTH; DRAW BY: ToV; LATEST REVISION NOTE: CREATION; VF LED: 3.2V, 3.2V, 2V; IF LED: 20mA; LUMINOUS INTENSITY: 400mcd,1700mcd,750mcd; VIEWING ANGLE: 120°; DRAW DATE: 01/04/2021; LATEST REVISION DATE: 01/04/2021; STATUS: ACTIVE; OPERATING TEMPERATURE: -40 +85°C; TECHNOLOGY: LED; DISPLAY: *; DIMENSION: *; CHANNEL: *; ISOLATION: *; COLOR: RGB; ROHS: ROHS; UL94: -; WEIGHT: -; MOUNTING: SMD; PACKAGING: PLCC6
R600-R602 = RC_0805_340R_1/4W_1%_M: RESISTOR SMD 0805 340R 1/4W 1% METAL; MANUFACTURER: KOA; MANUFACTURER REFERENCE: RK73H2ATTD3400F; DRAW BY: ToV; LATEST REVISION NOTE: CREATION; DRAW DATE: 22/06/2021; LATEST REVISION DATE: 22/06/2021; STATUS: ACTIVE; MATERIAL: METAL; WEIGHT: -; TEMPERATURE COEFFICIENT: -; ROHS: -; MOUNTING: SMD; PACKAGING: 0805
R603-R605 = RES_1k_1%_0402_RC0402FR-071KL: as R701 on sheet 07_MCU; TOLERANCE: 1%; MOUNTING: SMD; MANUFACTURER REFERENCE: RC0402FR-071KL; PACKAGING: 0402
R606-R608 = RES_11k_5%_0402_ERJ-2GEJ113X: as R703 on sheet 07_MCU; TOLERANCE: 5%; MOUNTING: SMD; MANUFACTURER REFERENCE: ERJ-2GEJ113X; PACKAGING: 0402
U600-U602 = MOS_N_1G_0.3A_DMN2005K: TRANSISTOR MOSFET N 0.3A 20V; MANUFACTURER: DIODES INC; DRAW BY: GFO; LATEST REVISION NOTE: CREATION; VCEsat/RDSon: 0.4@2.7V; VBEon/VGSth: 0.9V; VEB/VGSmax: 10V; PDmax: 0.35W; TJmax: 165°C; RTHJA: 357°C/W; UL94: V-0; DRAW DATE: 06/08/219; LATEST REVISION DATE: 06/08/2019; VALIDATED BY: -; STATUS: ACTIVE; OPERATING TEMPERATURE: -65 +150°C; TECHNOLOGY: MOSFET; TYPE: N; VCE/VDSmax: 20V; HFE/GFS: -; IC/IDmax: 0.3A; ROHS: ROHS; MOUNTING: SMD; PACKAGING: SOT-23-3

## Sheet 05_MOTORS.SchDoc: MOTORS
size A4; Author: Gabriel; Organization: Altium Limited; Address1: L3, 12a Rodborough Rd; Address2: Frenchs Forest; Address3: NSW; Address4: Australia 2086; Revision: v2.0; SheetNumber: 5; SheetTotal: 8; Subtitle: XDRONE
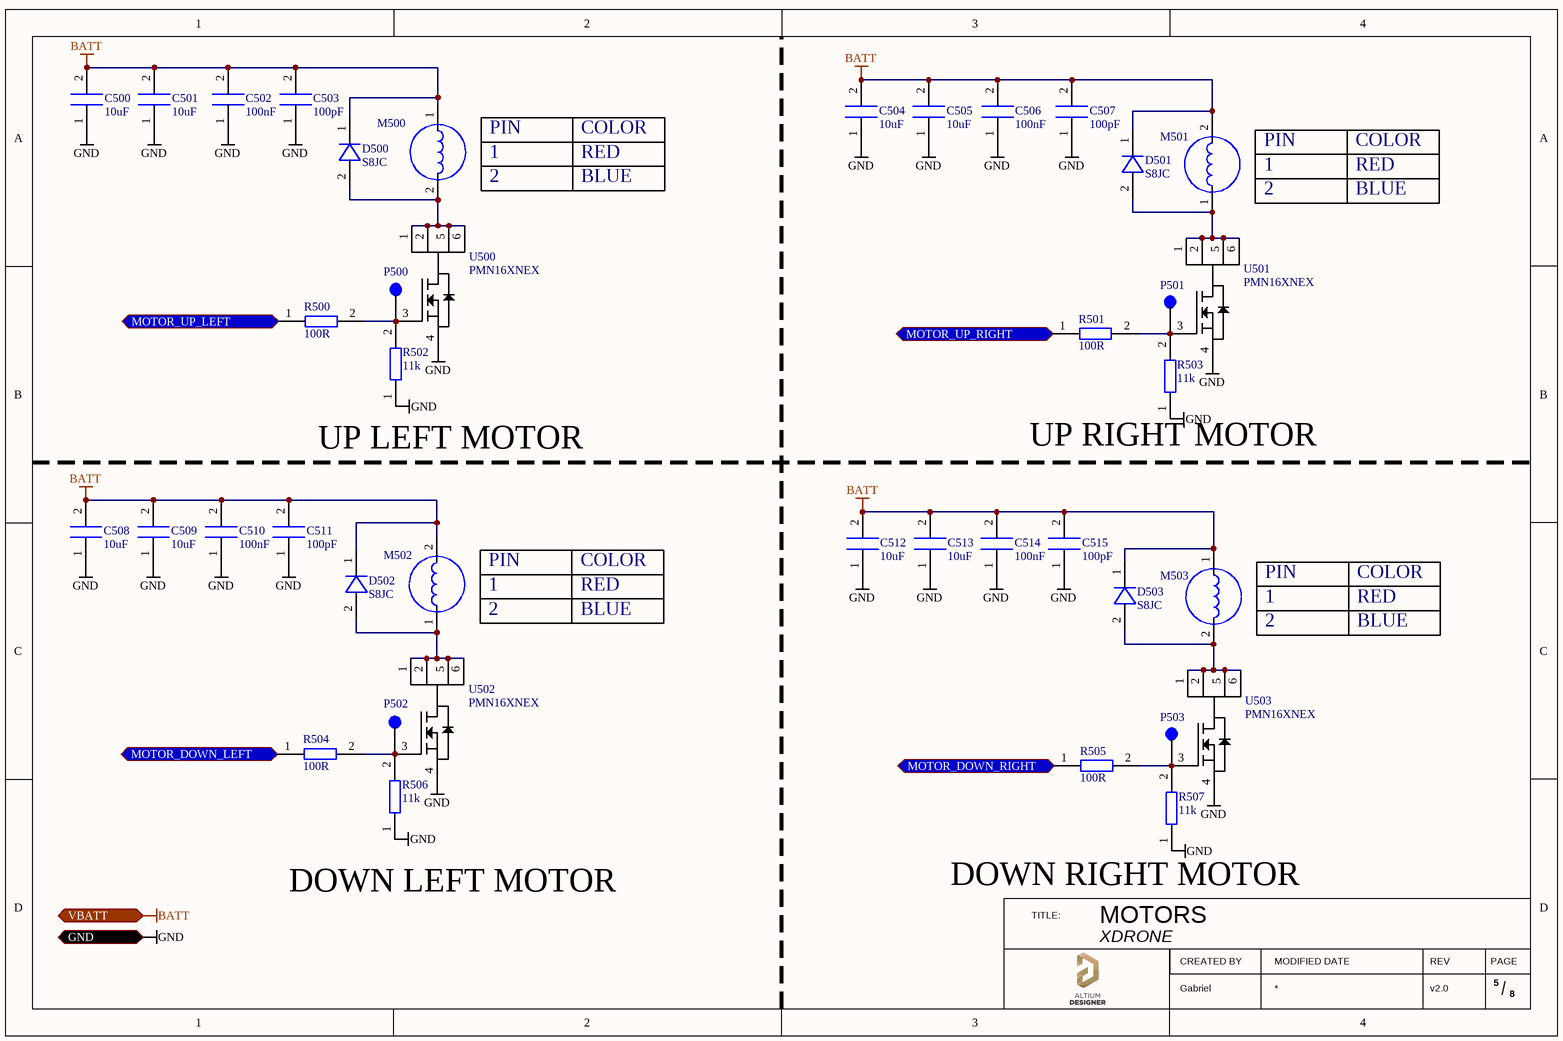
[diagram p6: 05_MOTORS.SchDoc]

### Parts
C500  value 10uF  [CAP_0805]  (hidden comment: 10uF_10%_10V_0805_X6S_GRM21BC81C106KA73L)
C501  value 10uF  [CAP_0805]  (hidden comment: 10uF_10%_10V_0805_X6S_GRM21BC81C106KA73L)
C502  value 100nF  [CAP_0402]  (hidden comment: 100nF_10%_16V_0402_GRM155R71C104KA88J)
C503  value 100pF  [CAP_0402]  (hidden comment: 100pF_5%_50V_0402_CC0402JRNPO9BN101)
C504  value 10uF  [CAP_0805]  (hidden comment: 10uF_10%_10V_0805_X6S_GRM21BC81C106KA73L)
C505  value 10uF  [CAP_0805]  (hidden comment: 10uF_10%_10V_0805_X6S_GRM21BC81C106KA73L)
C506  value 100nF  [CAP_0402]  (hidden comment: 100nF_10%_16V_0402_GRM155R71C104KA88J)
C507  value 100pF  [CAP_0402]  (hidden comment: 100pF_5%_50V_0402_CC0402JRNPO9BN101)
C508  value 10uF  [CAP_0805]  (hidden comment: 10uF_10%_10V_0805_X6S_GRM21BC81C106KA73L)
C509  value 10uF  [CAP_0805]  (hidden comment: 10uF_10%_10V_0805_X6S_GRM21BC81C106KA73L)
C510  value 100nF  [CAP_0402]  (hidden comment: 100nF_10%_16V_0402_GRM155R71C104KA88J)
C511  value 100pF  [CAP_0402]  (hidden comment: 100pF_5%_50V_0402_CC0402JRNPO9BN101)
C512  value 10uF  [CAP_0805]  (hidden comment: 10uF_10%_10V_0805_X6S_GRM21BC81C106KA73L)
C513  value 10uF  [CAP_0805]  (hidden comment: 10uF_10%_10V_0805_X6S_GRM21BC81C106KA73L)
C514  value 100nF  [CAP_0402]  (hidden comment: 100nF_10%_16V_0402_GRM155R71C104KA88J)
C515  value 100pF  [CAP_0402]  (hidden comment: 100pF_5%_50V_0402_CC0402JRNPO9BN101)
D500  MANUFACTURER REFERENCE: S8JC  [DO-214AB]  (hidden comment: DIODE_600V_8A_1Vf_S8JC)
D501  MANUFACTURER REFERENCE: S8JC  [DO-214AB]  (hidden comment: DIODE_600V_8A_1Vf_S8JC)
D502  MANUFACTURER REFERENCE: S8JC  [DO-214AB]  (hidden comment: DIODE_600V_8A_1Vf_S8JC)
D503  MANUFACTURER REFERENCE: S8JC  [DO-214AB]  (hidden comment: DIODE_600V_8A_1Vf_S8JC)
M500  BDC_1020_3.7V_4A  [1020_Motor]  (value not drawn)
M501  BDC_1020_3.7V_4A  [1020_Motor]  (value not drawn)
M502  BDC_1020_3.7V_4A  [1020_Motor]  (value not drawn)
M503  BDC_1020_3.7V_4A  [1020_Motor]  (value not drawn)
P500  TEST_POINT_2mm  [TEST_POINT_2mm]  (value not drawn)
P501  TEST_POINT_2mm  [TEST_POINT_2mm]  (value not drawn)
P502  TEST_POINT_2mm  [TEST_POINT_2mm]  (value not drawn)
P503  TEST_POINT_2mm  [TEST_POINT_2mm]  (value not drawn)
R500  value 100R  [RES_0402]  (hidden comment: RES_100R_1%_0402_RC0402FR-07100RL)
R501  value 100R  [RES_0402]  (hidden comment: RES_100R_1%_0402_RC0402FR-07100RL)
R502  value 11k  [RES_0402]  (hidden comment: RES_11k_5%_0402_ERJ-2GEJ113X)
R503  value 11k  [RES_0402]  (hidden comment: RES_11k_5%_0402_ERJ-2GEJ113X)
R504  value 100R  [RES_0402]  (hidden comment: RES_100R_1%_0402_RC0402FR-07100RL)
R505  value 100R  [RES_0402]  (hidden comment: RES_100R_1%_0402_RC0402FR-07100RL)
R506  value 11k  [RES_0402]  (hidden comment: RES_11k_5%_0402_ERJ-2GEJ113X)
R507  value 11k  [RES_0402]  (hidden comment: RES_11k_5%_0402_ERJ-2GEJ113X)
U500  MANUFACTURER REFERENCE: PMN16XNEX  [TSSOP-6]  (hidden comment: MOS_N_1G_20VDS_6.9A_0.65Vth_PMN16XNEX)
U501  MANUFACTURER REFERENCE: PMN16XNEX  [TSSOP-6]  (hidden comment: MOS_N_1G_20VDS_6.9A_0.65Vth_PMN16XNEX)
U502  MANUFACTURER REFERENCE: PMN16XNEX  [TSSOP-6]  (hidden comment: MOS_N_1G_20VDS_6.9A_0.65Vth_PMN16XNEX)
U503  MANUFACTURER REFERENCE: PMN16XNEX  [TSSOP-6]  (hidden comment: MOS_N_1G_20VDS_6.9A_0.65Vth_PMN16XNEX)

### Ports
GND (in), MOTOR_DOWN_LEFT (in), MOTOR_DOWN_RIGHT (in), MOTOR_UP_LEFT (in), MOTOR_UP_RIGHT (in), VBATT (in)

### Nets
BATT: C500.2 C501.2 C502.2 C503.2 C504.2 C505.2 C506.2 C507.2 C508.2 C509.2 C510.2 C511.2 C512.2 C513.2 C514.2 C515.2 D500.1 D501.1 D502.1 D503.1 M500.1 M501.2 M502.2 M503.1 ; port VBATT
GND: C500.1 C501.1 C502.1 C503.1 C504.1 C505.1 C506.1 C507.1 C508.1 C509.1 C510.1 C511.1 C512.1 C513.1 C514.1 C515.1 R502.1 R503.1 R506.1 R507.1 U500.4 U501.4 U502.4 U503.4 ; port GND
MOTOR_DOWN_LEFT: R504.1 ; port MOTOR_DOWN_LEFT
MOTOR_DOWN_RIGHT: R505.1 ; port MOTOR_DOWN_RIGHT
MOTOR_UP_LEFT: R500.1 ; port MOTOR_UP_LEFT
MOTOR_UP_RIGHT: R501.1 ; port MOTOR_UP_RIGHT
NetD500_2: D500.2 M500.2 U500.1 U500.2 U500.5 U500.6
NetD501_2: D501.2 M501.1 U501.1 U501.2 U501.5 U501.6
NetD502_2: D502.2 M502.1 U502.1 U502.2 U502.5 U502.6
NetD503_2: D503.2 M503.2 U503.1 U503.2 U503.5 U503.6
NetP500_1: P500.1 R500.2 R502.2 U500.3
NetP501_1: P501.1 R501.2 R503.2 U501.3
NetP502_1: P502.1 R504.2 R506.2 U502.3
NetP503_1: P503.1 R505.2 R507.2 U503.3

### Notes on the sheet
- (near M500) 1
- (near M500) PIN
- 2
- RED
- COLOR
- BLUE
- (near M501) 1
- (near M501) PIN
- (near R502) UP LEFT MOTOR
- (near R503) UP RIGHT MOTOR
- (near M502) 1
- (near M502) PIN
- (near M503) PIN
- (near M503) 1
- (near R506) DOWN LEFT MOTOR
- (near R507) DOWN RIGHT MOTOR
- TITLE:
- CREATED BY
- MODIFIED DATE
- REV
- PAGE
- /

### Library data of the parts
C500 C501 C504 C505 C508 C509 C512 C513 = 10uF_10%_10V_0805_X6S_GRM21BC81C106KA73L: CAP 10uF 10% 10V 0805 X6S; MANUFACTURER: MURATA; DIELECTRIC: X6S; TOLERANCE: 10%; VOLTAGE RATING: 10V; PACKAGING: 0805; MOUNTING: SMD; MANUFACTURER REFERENCE: GRM21BC81C106KA73L
C502 C506 C510 C514 = 100nF_10%_16V_0402_GRM155R71C104KA88J: as C401 on sheet 04_ALTIMETER; DIELECTRIC: X7R; TOLERANCE: 10%; MOUNTING: SMD; MANUFACTURER REFERENCE: GRM155R71C104KA88J; PACKAGING: 0402
C503 C507 C511 C515 = 100pF_5%_50V_0402_CC0402JRNPO9BN101: as C811 on sheet 08_MCU_POWER; TOLERANCE: 5%; VOLTAGE RATING: 50V; PACKAGING: 0402; MOUNTING: SMD; MANUFACTURER REFERENCE: CC0402JRNPO9BN101
D500-D503 = DIODE_600V_8A_1Vf_S8JC: DIODE 600V 8A 1Vf S8JC; MANUFACTURER: TAIWAN; FORWARD VOLTAGE: 1V; TYPE: NORMAL; REVERSE VOLTAGE MAX: 600V; CURRENT MAX: 8A; PACKAGING: DO-214AB; MOUNTING: SMD
M500-M503 = BDC_1020_3.7V_4A: Brushed DC motor 3.7V; MANUFACTURER: Aliexpress; MANUFACTURER REFERENCE: 1020; INPUT VOLTAGE MAX: 3.7; CURRENT MAX: 4A; PACKAGING: CUSTOM; MOUNTING: THT
R500 R501 R504 R505 = RES_100R_1%_0402_RC0402FR-07100RL: RESISTOR 100R 1% 0402 RC0402FR-07100RL; MANUFACTURER: YAGEO; VOLTAGE RATING: 50V; TOLERANCE: 1%; MOUNTING: SMD; MANUFACTURER REFERENCE: RC0402FR-07100RL; PACKAGING: 0402
R502 R503 R506 R507 = RES_11k_5%_0402_ERJ-2GEJ113X: as R703 on sheet 07_MCU; TOLERANCE: 5%; MOUNTING: SMD; MANUFACTURER REFERENCE: ERJ-2GEJ113X; PACKAGING: 0402
U500-U503 = MOS_N_1G_20VDS_6.9A_0.65Vth_PMN16XNEX: MOS N 1G 20VDS 6.9A 0.65Vth PMN16XNEX; MANUFACTURER: NEXPERIA; VOLTAGE DS MAX: 20V; NUMBER OF GATES: 1; VOLTAGE THRESHOLD: 0.65V; CURRENT MAX: 6.9A; PACKAGING: SOT-457; MOUNTING: SMD
P500-P503 = TEST_POINT_2mm: MOUNTING: SMD

## Sheet 02_POWER.SchDoc: POWER
size A4; Author: Gabriel; Organization: Altium Limited; Address1: L3, 12a Rodborough Rd; Address2: Frenchs Forest; Address3: NSW; Address4: Australia 2086; Revision: v2.0; SheetNumber: 2; SheetTotal: 8; Subtitle: XDRONE
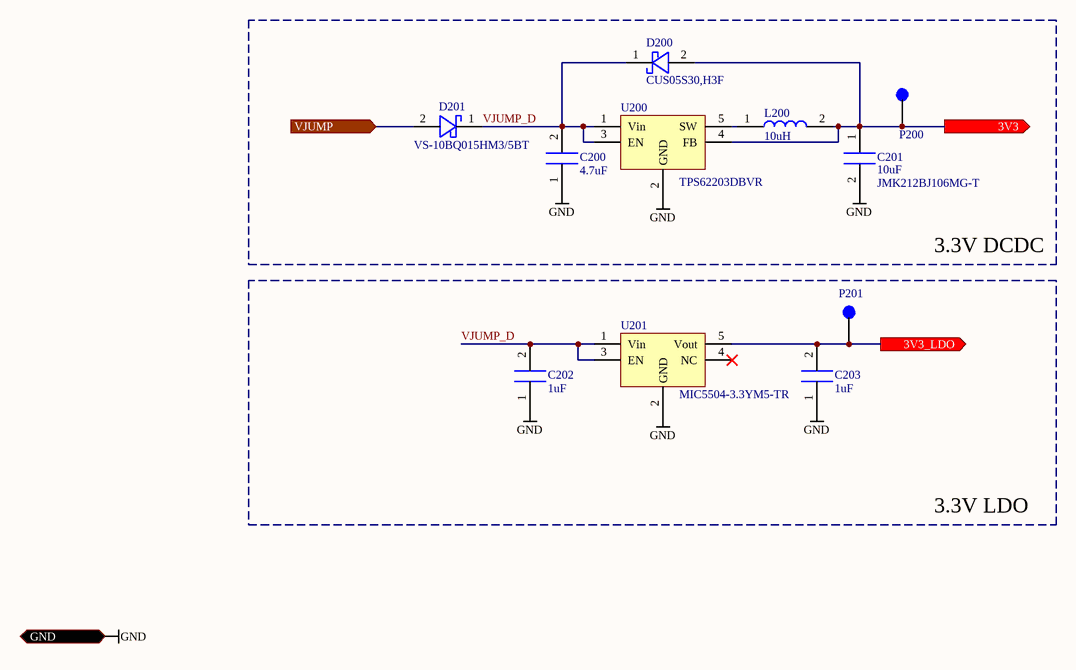
[diagram p7: 02_POWER.SchDoc]

### Parts
C200  value 4.7uF  [CAP_0805]  (hidden comment: 4.7uF_10%_16V_0805_X7R_GRM21BR71C475KE51L)
C201  value 10uF  MANUFACTURER REFERENCE: JMK212BJ106MG-T  [CAP_0805]  (hidden comment: 10uF_20%_6.3V_0805_X5R_JMK212BJ106MG-T)
C202  value 1uF  [CAP_0402]  (hidden comment: 1uF_10%_35V_0402_GRM155R6YA105KE11J)
C203  value 1uF  [CAP_0402]  (hidden comment: 1uF_10%_35V_0402_GRM155R6YA105KE11J)
D200  MANUFACTURER REFERENCE: CUS05S30,H3F  [SOD-323]  (hidden comment: DIODE_30V_500mA_340mVf_CUS05S30,H3F)
D201  MANUFACTURER REFERENCE: VS-10BQ015HM3/5BT  [DO-214AA]  (hidden comment: DIODE_15V_1A_210mVf_VS-10BQ015HM3/5BT)
L200  value 10uH  [IND_CDRH5D28]  (hidden comment: 10uH_30%_1.3A_CDRH5D28-100NC)
P200  TEST_POINT_2mm  [TEST_POINT_2mm]  (value not drawn)
P201  TEST_POINT_2mm  [TEST_POINT_2mm]  (value not drawn)
U200  MANUFACTURER REFERENCE: TPS62203DBVR  [SC-74A-5 SOT-23-5]  (hidden comment: DCDC_6VIN_3.3VOUT_600mA_TPS62203DBVR)
U201  MANUFACTURER REFERENCE: MIC5504-3.3YM5-TR  [SC-74A-5 SOT-23-5]  (hidden comment: LDO_6Vin_3.3Vout_MIC5504-3.3YM5-TR)

### Blocks framed on the sheet
3.3V DCDC: C200 C201 D200 D201 L200 P200 U200
3.3V LDO: C202 C203 P201 U201

### Ports
3V3 (out), 3V3_LDO (out), GND (in), VJUMP (in)

### Nets
3V3: C201.1 D200.2 L200.2 P200.1 U200.4(FB) ; port 3V3
3V3_LDO: C203.2 P201.1 U201.5(Vout) ; port 3V3_LDO
GND: C200.1 C201.2 C202.1 C203.1 U200.2(GND) U201.2(GND) ; port GND
VJUMP_D: C200.2 C202.2 D200.1 D201.1 U200.1(Vin) U200.3(EN) U201.1(Vin) U201.3(EN)
NetD201_2: D201.2 ; port VJUMP
NetL200_1: L200.1 U200.5(SW)

Not connected (* = marked no-connect by the designer): U201 4(NC)*

### Notes on the sheet
- TITLE:
- CREATED BY
- MODIFIED DATE
- REV
- PAGE
- /

### Library data of the parts
C200 = 4.7uF_10%_16V_0805_X7R_GRM21BR71C475KE51L: CAP 4.7uF 10% 16V 0805 X7R; MANUFACTURER: MURATA; DIELECTRIC: X7R; TOLERANCE: 10%; VOLTAGE RATING: 16V; PACKAGING: 0805; MOUNTING: SMD; MANUFACTURER REFERENCE: GRM21BR71C475KE51L
C201 = 10uF_20%_6.3V_0805_X5R_JMK212BJ106MG-T: CAP 10uF 20% 6.3V 0805 X5R; MANUFACTURER: TAYIO YUDEN; DIELECTRIC: X5R; TOLERANCE: 20%; VOLTAGE RATING: 6.3V; PACKAGING: 0805; MOUNTING: SMD
C202 C203 = 1uF_10%_35V_0402_GRM155R6YA105KE11J: as C804 on sheet 08_MCU_POWER; DIELECTRIC: X5R; TOLERANCE: 10%; MOUNTING: SMD; MANUFACTURER REFERENCE: GRM155R6YA105KE11J; PACKAGING: 0402
D200 = DIODE_30V_500mA_340mVf_CUS05S30,H3F: DIODE 30V 500mA 340mVf CUS05S30,H3F; MANUFACTURER: TOSHIBA; FORWARD VOLTAGE: 340mV; TYPE: SCHOTTKY; REVERSE VOLTAGE MAX: 30V; CURRENT MAX: 500mA; PACKAGING: SOD-323; MOUNTING: SMD
D201 = DIODE_15V_1A_210mVf_VS-10BQ015HM3/5BT: DIODE 15V 1A 210mVf VS-10BQ015HM3/5BT; MANUFACTURER: VISHAY; FORWARD VOLTAGE: 210mV; TYPE: SCHOTTKY; REVERSE VOLTAGE MAX: 15V; CURRENT MAX: 1A; PACKAGING: DO-214AA; MOUNTING: SMD
L200 = 10uH_30%_1.3A_CDRH5D28-100NC: INDUCTOR 10uH 30% 1.3A CDRH5D28-100NC; MANUFACTURER: SUMIDA; TOLERANCE: 30%; MOUNTING: SMD; MANUFACTURER REFERENCE: CDRH5D28-100NC; CURRENT RATING: 1.3A
U200 = DCDC_5VIN_3.3VOUT_1A_TPS62203DBVR: DCDC 2-5Vin 3.3Vout 1A 300mA TPS62203DBVR; MANUFACTURER: TI; INPUT VOLTAGE MIN: 2.5V; INPUT VOLTAGE MAX: 6V; OUTPUT VOLTAGE: 3.3V; CURRENT MAX: 300mA; PACKAGING: SOT-23-5; MOUNTING: SMD
U201 = LDO_6Vin_3.3Vout_MIC5504-3.3YM5-TR: LDO 6Vin 3.3Vout MIC5504-3.3YM5-TR; MANUFACTURER: MICROCHIP; INPUT VOLTAGE MIN: 2.5V; INPUT VOLTAGE MAX: 6V; OUTPUT VOLTAGE: 3.3V; CURRENT MAX: 300mA; PACKAGING: SOT-23-5; MOUNTING: SMD
P200 P201 = TEST_POINT_2mm: MOUNTING: SMD

## Nets that join several sheets
3V3: 07_MCU (J700.1 R704.2 R705.2 U701.2), 08_MCU_POWER (17 pins), 06_LEDS (D600.2 D600.4 D600.6), 02_POWER (5 pins)
3V3_LDO: 04_ALTIMETER (5 pins), 03_GYROSCOPE (7 pins), 02_POWER (C203.2 P201.1 U201.5)
BATT: 01_XDRONE (J100.1 J101.1 P100.1), 07_MCU (R700.2 R701.2), 05_MOTORS (24 pins)
GND: 01_XDRONE (J101.2 P102.1 P103.1), 04_ALTIMETER (5 pins), 03_GYROSCOPE (5 pins), 07_MCU (17 pins), 08_MCU_POWER (25 pins), 06_LEDS (6 pins), 05_MOTORS (24 pins), 02_POWER (6 pins)
ALTIMETER_CLK: 04_ALTIMETER (P400.1 U400.4), 07_MCU (U700.2)
ALTIMETER_CS#: 04_ALTIMETER (P401.1 U400.2), 07_MCU (U700.1)
ALTIMETER_MISO: 04_ALTIMETER (P402.1 U400.5), 07_MCU (U700.4)
ALTIMETER_MOSI: 04_ALTIMETER (P403.1 U400.3), 07_MCU (U700.3)
GYRO_CS#: 03_GYROSCOPE (P301.1 U300.12), 07_MCU (U700.24)
GYRO_INT1: 03_GYROSCOPE (P302.1 U300.4), 07_MCU (U700.31)
GYRO_INT2: 03_GYROSCOPE (P303.1 U300.9), 07_MCU (U700.32)
GYRO_MISO: 03_GYROSCOPE (P304.1 U300.1), 07_MCU (U700.21)
GYRO_MOSI: 03_GYROSCOPE (P305.1 U300.14), 07_MCU (U700.22)
GYRO_SCK: 03_GYROSCOPE (P300.1 U300.13), 07_MCU (U700.23)
LED_BLUE: 07_MCU (U700.35), 06_LEDS (R605.1)
LED_GREEN: 07_MCU (U700.34), 06_LEDS (R604.1)
LED_RED: 07_MCU (U700.33), 06_LEDS (R603.1)
MOTOR_DOWN_LEFT: 07_MCU (U700.8), 05_MOTORS (R504.1)
MOTOR_DOWN_RIGHT: 07_MCU (U700.9), 05_MOTORS (R505.1)
MOTOR_UP_LEFT: 07_MCU (U700.7), 05_MOTORS (R500.1)
MOTOR_UP_RIGHT: 07_MCU (U700.10), 05_MOTORS (R501.1)
NetD201_2: 01_XDRONE (J100.2 P101.1), 02_POWER (D201.2)
RESETn: 07_MCU (B702.3 B702.4 D701.4 J700.3), 08_MCU_POWER (R800.1 U700.13)